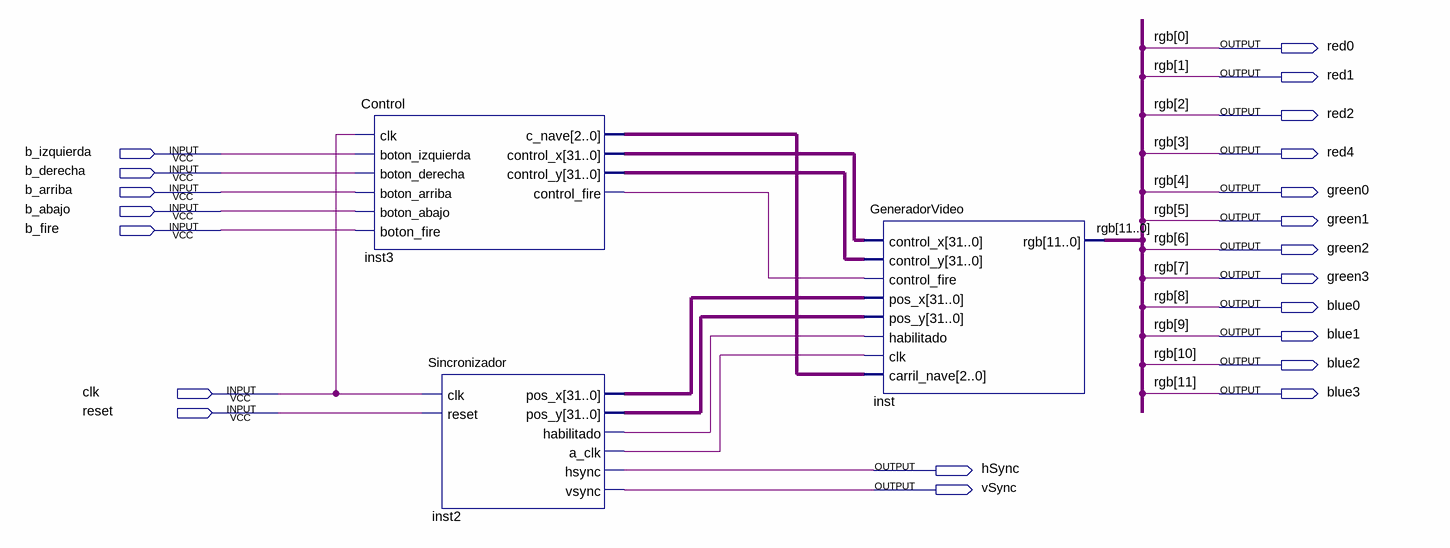
[diagram p0: schematic sheet]
// Quartus schematic VGA.bdf as structural Verilog: 3 symbols, 21 pins
module VGA (
  input  b_izquierda,
  input  b_derecha,
  input  b_arriba,
  input  b_abajo,
  input  b_fire,
  input  clk,
  input  reset,
  output red0,
  output red1,
  output red2,
  output red4,
  output green0,
  output green1,
  output green2,
  output green3,
  output blue0,
  output blue1,
  output blue2,
  output blue3,
  output hSync,
  output vSync
);

  wire inst2_a_clk, inst2_habilitado, inst3_control_fire;
  wire [2:0] inst3_c_nave;
  wire [31:0] inst2_pos_x, inst2_pos_y, inst3_control_x, inst3_control_y;

  Control inst3 (
    .clk(clk), .boton_izquierda(b_izquierda), .boton_derecha(b_derecha), .boton_arriba(b_arriba),
    .boton_abajo(b_abajo), .boton_fire(b_fire), .c_nave(inst3_c_nave), .control_x(inst3_control_x),
    .control_y(inst3_control_y), .control_fire(inst3_control_fire));
  Sincronizador inst2 (
    .clk(clk), .reset(reset), .pos_x(inst2_pos_x), .pos_y(inst2_pos_y), .habilitado(inst2_habilitado),
    .a_clk(inst2_a_clk), .hsync(hSync), .vsync(vSync));
  GeneradorVideo inst (
    .control_x(inst3_control_x), .control_y(inst3_control_y), .control_fire(inst3_control_fire),
    .pos_x(inst2_pos_x), .pos_y(inst2_pos_y), .habilitado(inst2_habilitado), .clk(inst2_a_clk),
    .carril_nave(inst3_c_nave),
    .rgb({blue3, blue2, blue1, blue0, green3, green2, green1, green0, red4, red2, red1, red0}));

  // Other names for the same wires on the sheet: rgb[11:0] = {blue3, blue2, blue1, blue0, green3, green2, green1, green0, red4, red2, red1, red0}
endmodule
